# EasyEDA schematic SCH_customPCB_2026-04-30.json
TITLE: Sheet_1; REV: 1.0; Date: 2026-04-29; Sheet: 1/1; Drawn By: armanaraqelyan1107; Company: Your Company
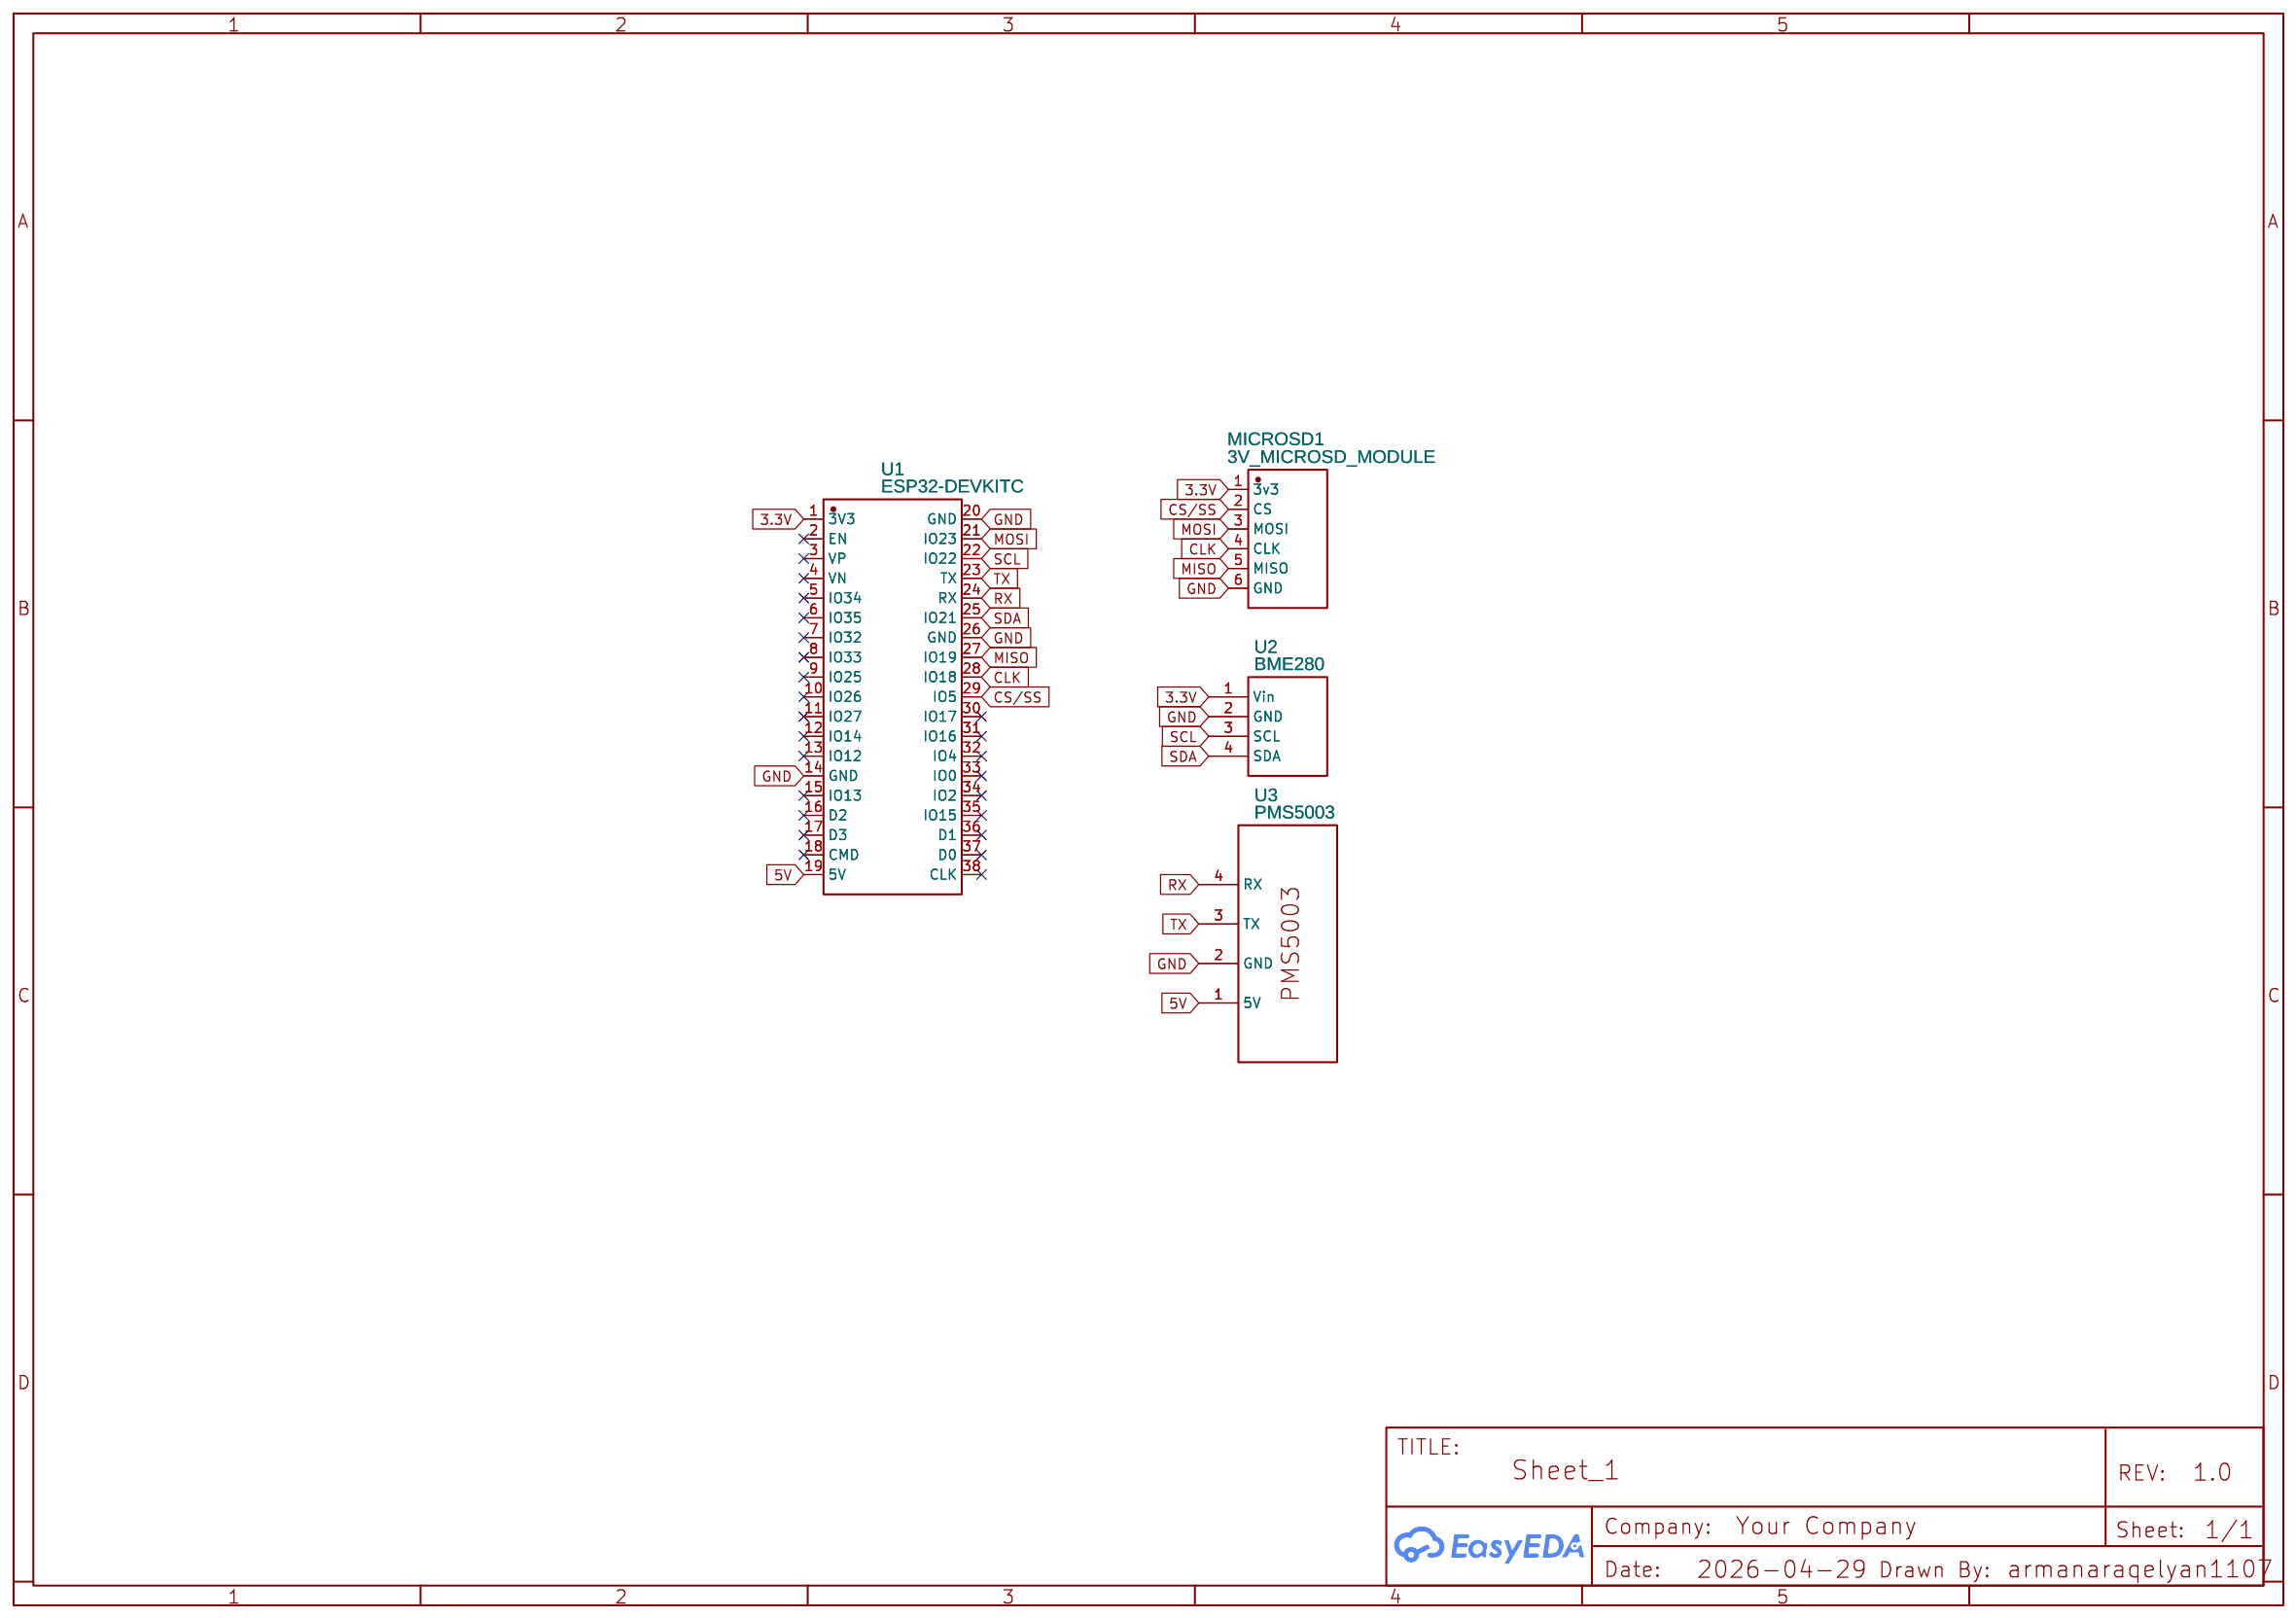
[diagram p0: schematic sheet]

## Parts
MICROSD1  3V_MICROSD_MODULE  [3V_SDCARD_MODULE]
U1  ESP32-DEVKITC  [BULETM-SMD_ESP32-DEVKITC]
U2  BME280  [BME280]
U3  PMS5003  [PMS5003]

## Library data of the parts
MICROSD1 = 3V_MICROSD_MODULE: Contributor: neeharis
U1 = ESP32-DEVKITC: Supplier: LCSC; Supplier Part: C571180; Manufacturer: ESPRESSIF(乐鑫); Manufacturer Part: ESP32-DevKitC; Contributor: lcsc
U2 = BME280: Contributor: austrez
U3 = PMS5003: Contributor: infernostorm06

## Nets
3.3V: MICROSD1.1(3v3) U1.1(3V3) U2.1(Vin)
5V: U1.19(5V) U3.1(5V)
GND: MICROSD1.6(GND) U1.14(GND) U1.20(GND) U1.26(GND) U2.2(GND) U3.2(GND)
CLK: MICROSD1.4(CLK) U1.28(IO18)
CS/SS: MICROSD1.2(CS) U1.29(IO5)
MISO: MICROSD1.5(MISO) U1.27(IO19)
MOSI: MICROSD1.3(MOSI) U1.21(IO23)
RX: U1.24(RX) U3.4(RX)
SCL: U1.22(IO22) U2.3(SCL)
SDA: U1.25(IO21) U2.4(SDA)
TX: U1.23(TX) U3.3(TX)

Not connected (* = marked no-connect by the designer): U1 2(EN)* 3(VP)* 4(VN)* 5(IO34)* 6(IO35)* 7(IO32)* 8(IO33)* 9(IO25)* 10(IO26)* 11(IO27)* 12(IO14)* 13(IO12)* 15(IO13)* 16(D2)* 17(D3)* 18(CMD)* 30(IO17)* 31(IO16)* 32(IO4)* 33(IO0)* 34(IO2)* 35(IO15)* 36(D1)* 37(D0)* 38(CLK)*
